# Altium schematic sheet Sheet1.SchDoc
size A; SheetNumber: 1; SheetTotal: 1
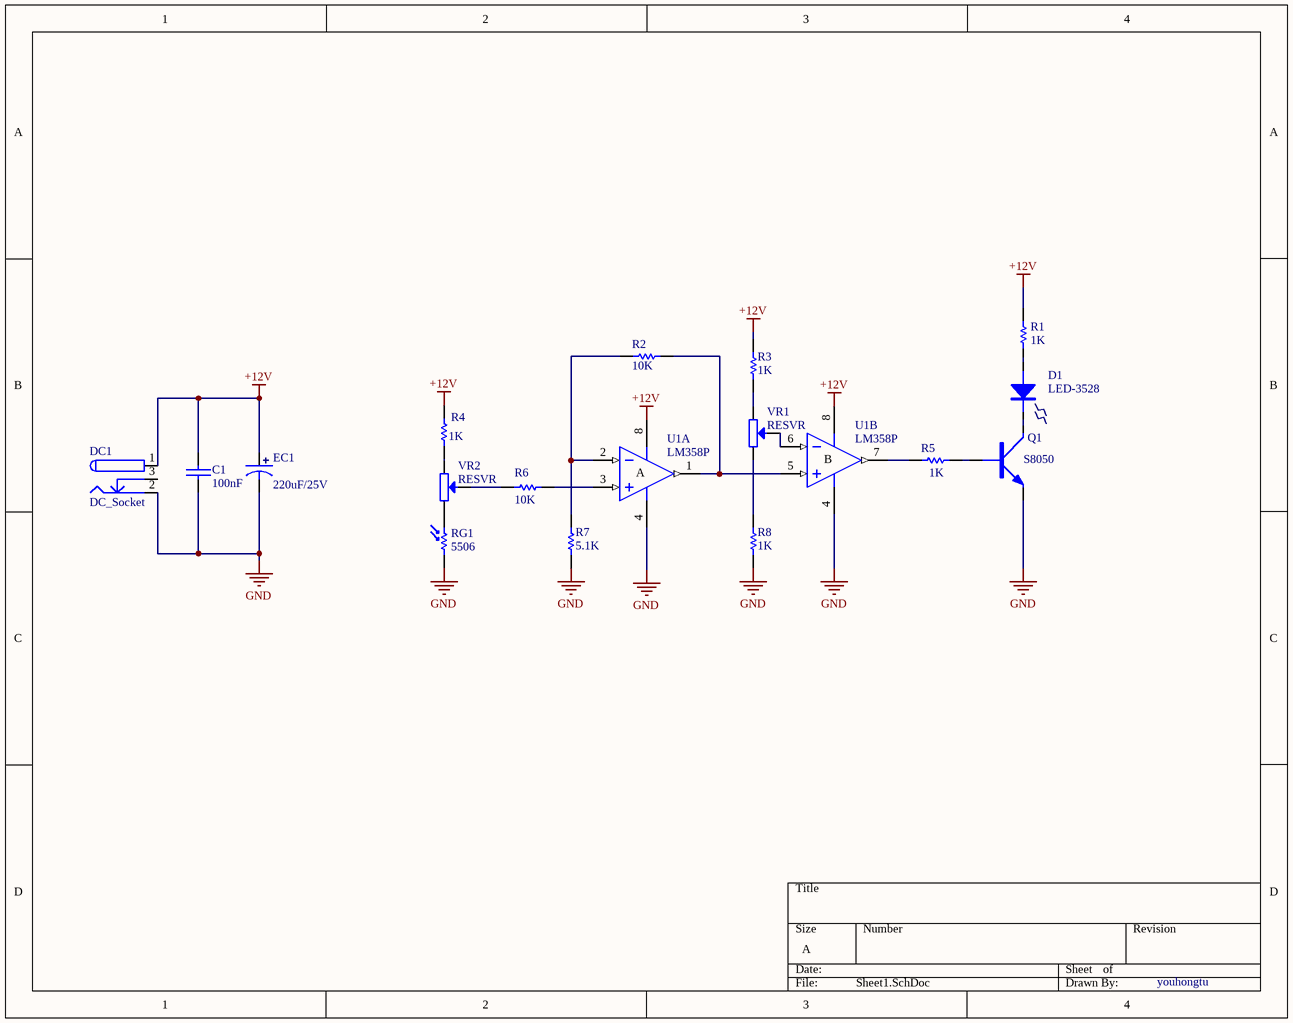
[diagram p0: Sheet1.SchDoc]

## Parts
C1  100nF  [RAD-0.2]
D1  LED-3528  [LED3-RED]
DC1  DC_Socket  [DC-005]
EC1  220uF/25V  [DIP-EC3.5X8X11.5]
Q1  S8050  [TO-92A]
R1  1K  [AXIAL0.4]
R2  10K  [AXIAL0.4]
R3  1K  [AXIAL0.4]
R4  1K  [AXIAL0.4]
R5  1K  [AXIAL0.4]
R6  10K  [AXIAL0.4]
R7  5.1K  [AXIAL0.4]
R8  1K  [AXIAL0.4]
RG1  5506  [Photoresistor]
U1  LM358P  [P008]  (parts A,B of 2)
VR1  RESVR  [3296W]
VR2  RESVR  [3296W]

## Nets
+12V: C1.2 DC1.1 EC1.1 R1.2 R3.2 R4.2 U1.8(V+)
GND: C1.1 DC1.2 EC1.2 Q1.E R7.1 R8.1 RG1.1 U1.4(V-)
NetD1_A: D1.A R1.1
NetD1_K: D1.K Q1.C
NetQ1_B: Q1.B R5.2
NetR2_1: R2.1 U1.1(OUT) U1.5(IN+)
NetR2_2: R2.2 R7.2 U1.2(IN-)
NetR3_1: R3.1 VR1.1
NetR4_1: R4.1 VR2.1
NetR5_1: R5.1 U1.7(OUT)
NetR6_1: R6.1 U1.3(IN+)
NetR6_2: R6.2 VR2.3
NetR8_2: R8.2 VR1.2
NetRG1_2: RG1.2 VR2.2
NetU1_6: U1.6(IN-) VR1.3

Not connected (* = marked no-connect by the designer): DC1 3

## Notes on the sheet
- youhongtu
- (in symbol LM358P, part A) A
- (in symbol LM358P, part B) B

## Library data of the parts
C1 = CAP: 无极性电容
EC1 = DIP_ECAP: 直插电解电容
Q1 = NPN: NPN三极管
R1-R8 = RES
RG1 = Photoresistor: 光敏电阻
U1 = LM358P: Dual Operational Amplifier; Published: 16-Jan-2001; LatestRevisionDate: 04-Mar-2005; LatestRevisionNote: Stylized 3D Model Added.; DatasheetVersion: Jul-1998; PackageVersion: Jun-1999; PackageReference: P008; Publisher: Altium Limited; PackageDescription: DIP; 8 Leads; Row Spacing 7.62 mm; Pitch 2.54 mm; Code_JEDEC: MO-001-AN; ComponentLink1Description: Manufacturer Link; ComponentLink1URL: http://www.ti.com/; ComponentLink2Description: Datasheet; ComponentLink2URL: http://www-s.ti.com/sc/ds/lm358.pdf